# Altium schematic sheet 水位控制系统-控制端.SchDoc
size A4
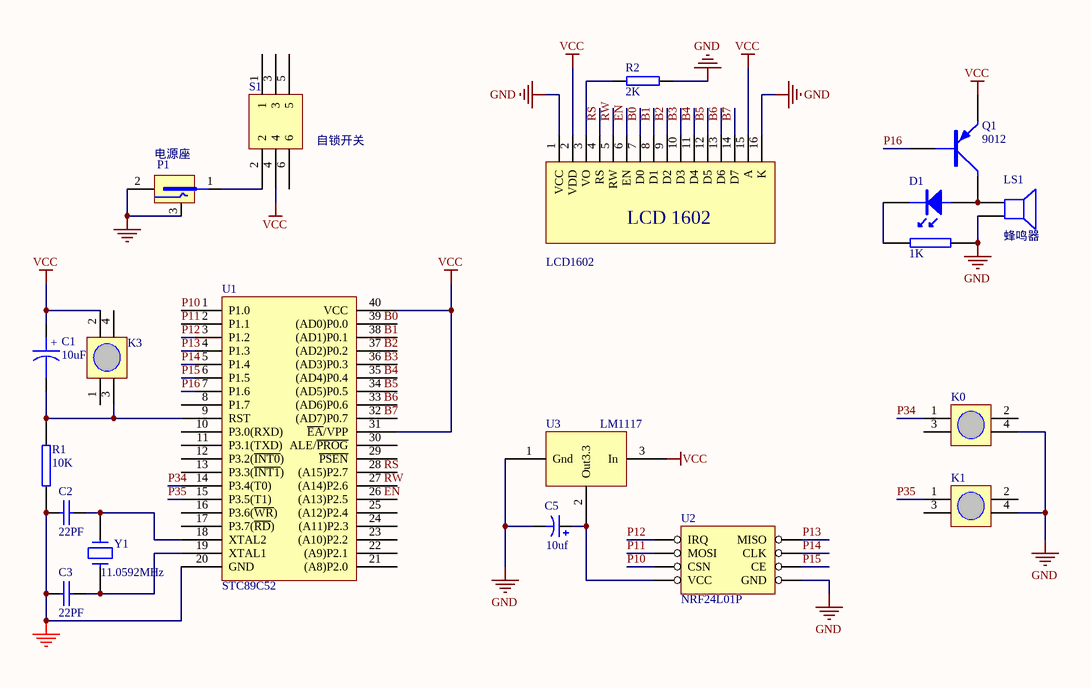
[diagram p0: 水位控制系统-控制端.SchDoc]

## Parts
1  LCD1602  [1602]
C1  10uF  [C100]
C2  22PF  [C01]
C3  22PF  [C01]
C5  10uf  [RB7.6-15]
D1  (no value)  [LED5]
K0  (no value)  [KEY]
K1  (no value)  [KEY]
K3  (no value)  [KEY]
LS1  蜂鸣器  [SIP2]
P1  电源座  [DC2.1]
Q1  9012  [9014]
R1  10K  [R-DIP]
R2  2K  [电阻]
R?  1K  [R-DIP]
S1  自锁开关  [SW6]
U1  STC89C52  [DIP40]
U2  NRF24L01P  [2401]
U3  LM1117  [SOT-223 - 3]
Y1  11.0592MHz  [JZ]

## Nets
GND: 1.1(VCC) 1.16(K) C2.2 C3.2 C5.2 K0.4 K1.4 LS1.2 P1.2 P1.3 R1.2 R2.2 R?.2 U1.20(GND) U2.1(GND) U3.1(Gnd)
VCC: 1.2(VDD) 1.15(A) C1.1 K3.2 Q1.2(E) S1.4 U1.31(~{EA}/VPP) U1.40(VCC) U3.3(In)
B0: 1.7(D0)
B1: 1.8(D1)
B2: 1.9(D2)
B3: 1.10(D3)
B4: 1.11(D4)
B5: 1.12(D5)
B6: 1.13(D6)
B7: 1.14(D7)
EN: 1.6(EN)
P10: U1.1(P1.0) U2.4(CSN)
P11: U1.2(P1.1) U2.6(MOSI)
P12: U1.3(P1.2) U2.8(IRQ)
P13: U1.4(P1.3) U2.7(MISO)
P14: U1.5(P1.4) U2.5(CLK)
P15: U1.6(P1.5) U2.3(CE)
P16: Q1.1(B) U1.7(P1.6)
P34: K0.1 U1.14(P3.4(T0))
P35: K1.1 U1.15(P3.5(T1))
RS: 1.4(RS)
RW: 1.5(RW)
Net1_3: 1.3(VO) R2.1
NetC1_2: C1.2 K3.3 R1.1 U1.9(RST)
NetC2_1: C2.1 U1.18(XTAL2) Y1.1
NetC3_1: C3.1 U1.19(XTAL1) Y1.2
NetC5_1: C5.1 U2.2(VCC) U3.2(Out3.3)
NetD1_A: D1.A LS1.1 Q1.3(C)
NetD1_K: D1.K R?.1
NetP1_1: P1.1 S1.2

Not connected (* = marked no-connect by the designer): K0 2 3; K1 2 3; K3 1 4; S1 1 3 5 6; U1 8(P1.7) 10(P3.0(RXD)) 11(P3.1(TXD)) 12(P3.2(~{INT0})) 13(P3.3(~{INT1})) 16(P3.6(~{WR})) 17(P3.7(~{RD})) 21((A8)P2.0) 22((A9)P2.1) 23((A10)P2.2) 24((A11)P2.3) 25((A12)P2.4) 26((A13)P2.5) 27((A14)P2.6) 28((A15)P2.7) 29(~{PSEN}) 30(ALE/~{PROG}) 32((AD7)P0.7) 33((AD6)P0.6) 34((AD5)P0.5) 35((AD4)P0.4) 36((AD3)P0.3) 37((AD2)P0.2) 38((AD1)P0.1) 39((AD0)P0.0)

## Notes on the sheet
- Labels drawn without touching a wire or pin: B0, B1, B2, B3, B4, B5, B6, B7, EN, RS, RW
- (in symbol 1602) LCD 1602
- (in symbol CAPACITOR POL) +

## Library data of the parts
1 = 1602
C1 = CAPACITOR POL: Capacitor
C2 C3 = CAP: Capacitor
C5 = Cap Pol1: Polarized Capacitor (Radial); Published: 8-Jun-2000; LatestRevisionDate: 17-Jul-2002; LatestRevisionNote: Re-released for DXP Platform.; PackageReference: RB7.6-15; Publisher: Altium Limited
D1 = LED
K0 K1 K3 = KEY
LS1 = Speaker: Loudspeaker; Published: 24-Mar-1999; LatestRevisionDate: 17-Jul-2002; LatestRevisionNote: Re-released for DXP Platform.; PackageReference: PIN2; Publisher: Altium Limited
P1 = POWER
Q1 = PNP2: PNP Transistor
R1 R? = RES2
R2 = 电阻-定值
S1 = SWITCH
U1 = AT89C51
Y1 = CRYSTAL